# EAGLE schematic Backplane (EAGLE 9.6.2)
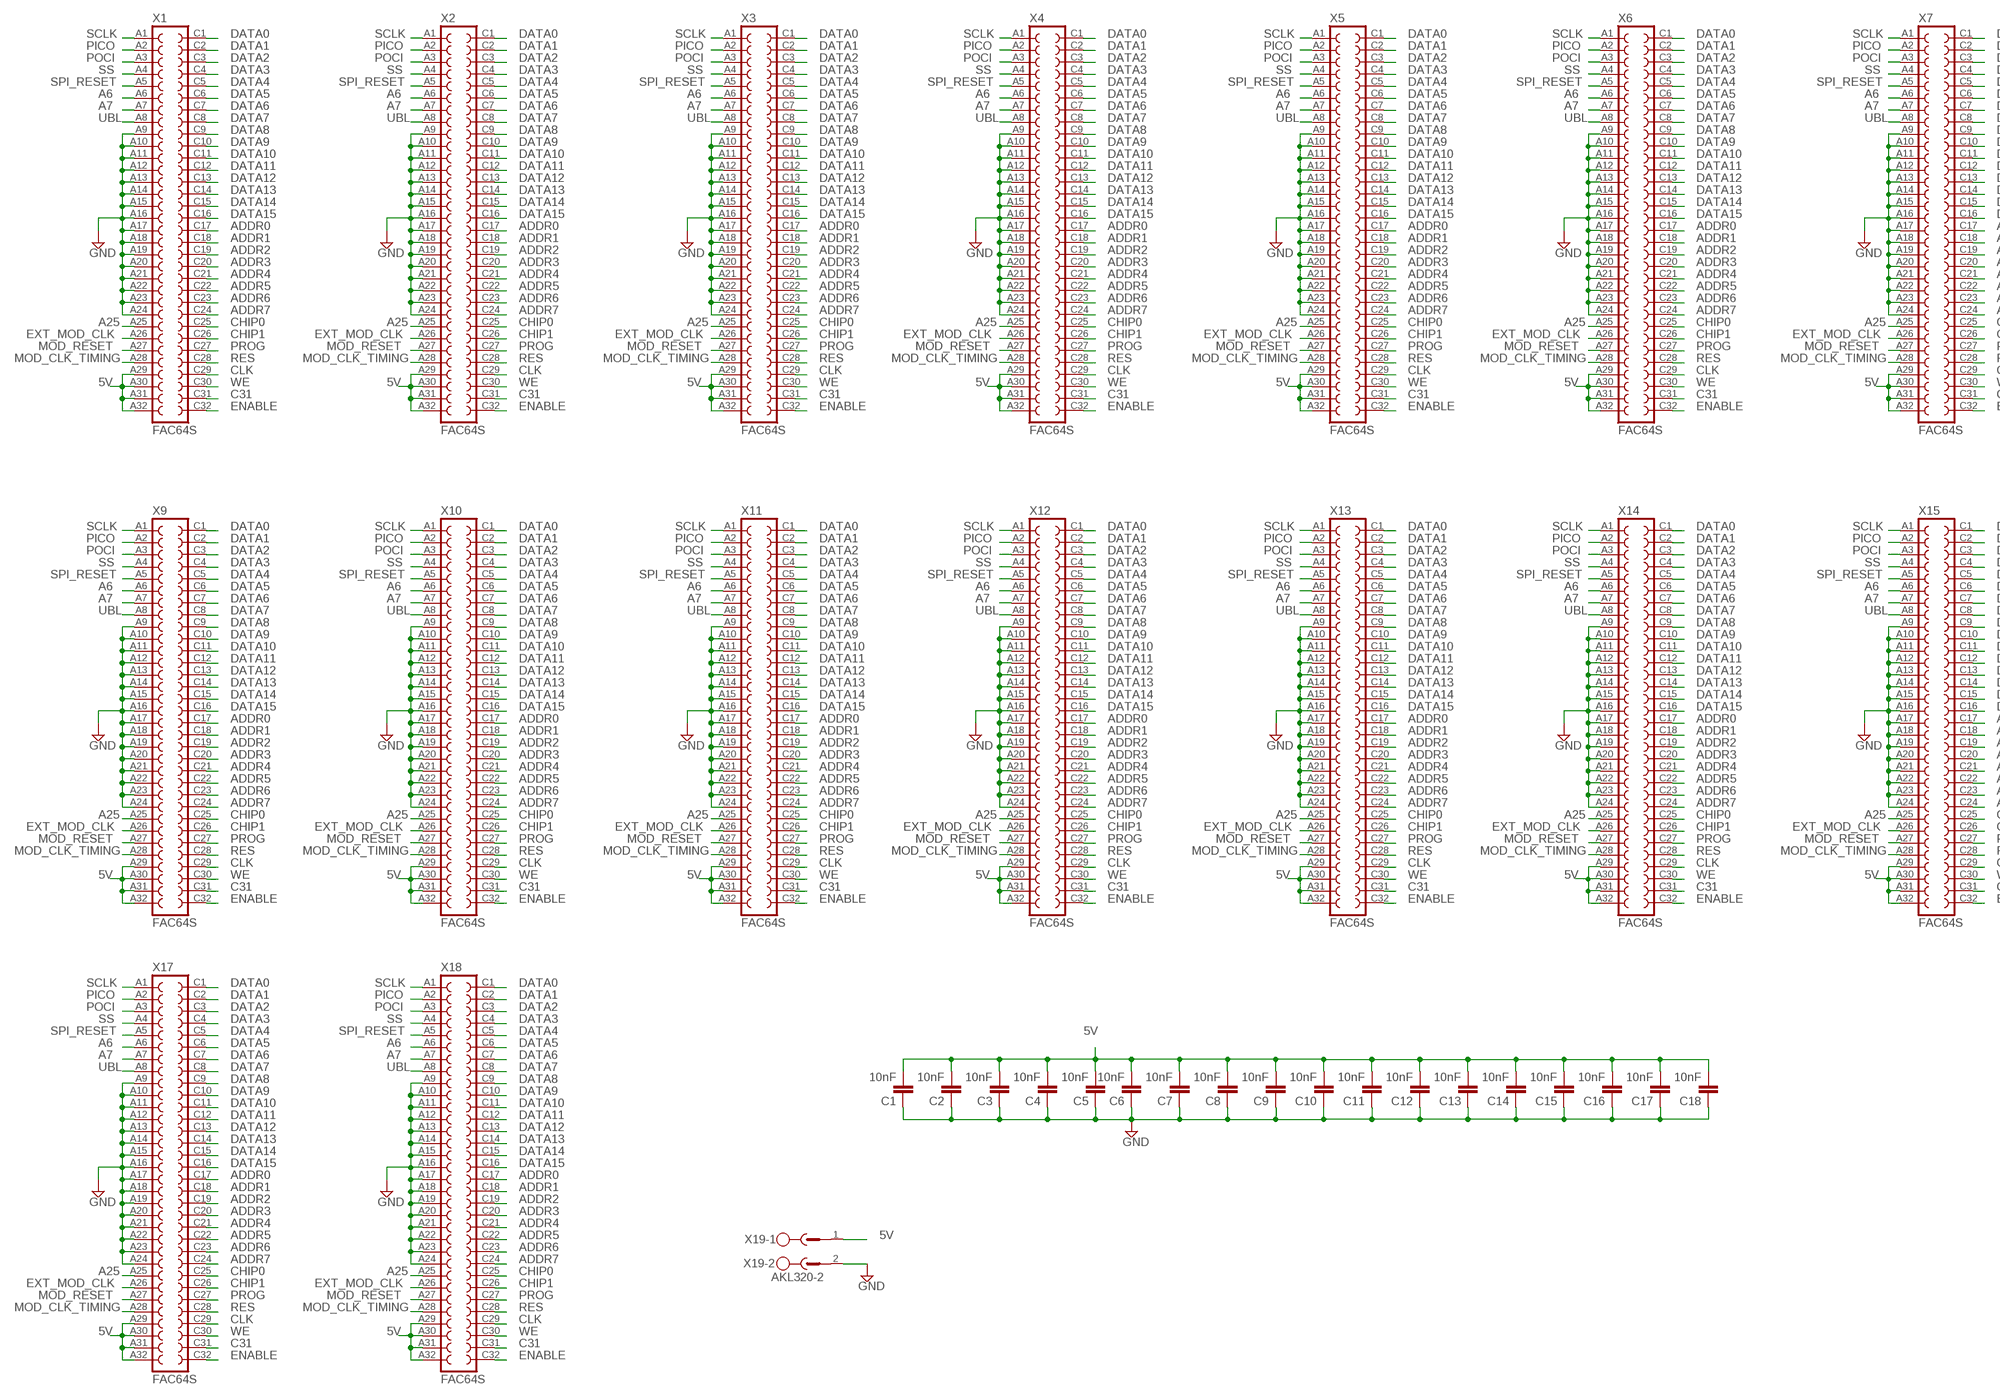
[diagram p0: schematic, sheet 1, part 1 of 2]
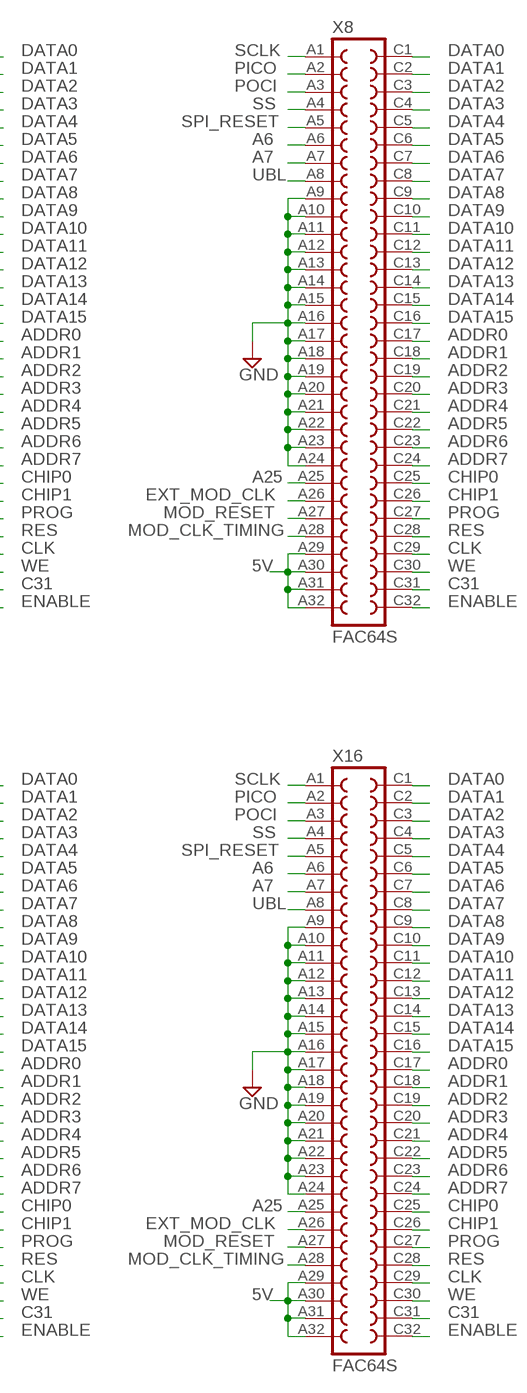
[diagram p1: schematic, sheet 1, part 2 of 2]

## Parts
C1  10nF  C-EUC0603  [C0603]
C2  10nF  C-EUC0603  [C0603]
C3  10nF  C-EUC0603  [C0603]
C4  10nF  C-EUC0603  [C0603]
C5  10nF  C-EUC0603  [C0603]
C6  10nF  C-EUC0603  [C0603]
C7  10nF  C-EUC0603  [C0603]
C8  10nF  C-EUC0603  [C0603]
C9  10nF  C-EUC0603  [C0603]
C10  10nF  C-EUC0603  [C0603]
C11  10nF  C-EUC0603  [C0603]
C12  10nF  C-EUC0603  [C0603]
C13  10nF  C-EUC0603  [C0603]
C14  10nF  C-EUC0603  [C0603]
C15  10nF  C-EUC0603  [C0603]
C16  10nF  C-EUC0603  [C0603]
C17  10nF  C-EUC0603  [C0603]
C18  10nF  C-EUC0603  [C0603]
X1  FAC64S  [FAC64S]
X2  FAC64S  [FAC64S]
X3  FAC64S  [FAC64S]
X4  FAC64S  [FAC64S]
X5  FAC64S  [FAC64S]
X6  FAC64S  [FAC64S]
X7  FAC64S  [FAC64S]
X8  FAC64S  [FAC64S]
X9  FAC64S  [FAC64S]
X10  FAC64S  [FAC64S]
X11  FAC64S  [FAC64S]
X12  FAC64S  [FAC64S]
X13  FAC64S  [FAC64S]
X14  FAC64S  [FAC64S]
X15  FAC64S  [FAC64S]
X16  FAC64S  [FAC64S]
X17  FAC64S  [FAC64S]
X18  FAC64S  [FAC64S]
X19  AKL320-2  MSTBV2  [MSTBV2]

## Nets
5V: C1.2 C2.2 C3.2 C4.2 C5.2 C6.2 C7.2 C8.2 C9.2 C10.2 C11.2 C12.2 C13.2 C14.2 C15.2 C16.2 C17.2 C18.2 X1.A29 X1.A30 X1.A31 X1.A32 X2.A29 X2.A30 X2.A31 X2.A32 X3.A29 X3.A30 X3.A31 X3.A32 X4.A29 X4.A30 X4.A31 X4.A32 X5.A29 X5.A30 X5.A31 X5.A32 X6.A29 X6.A30 X6.A31 X6.A32 X7.A29 X7.A30 X7.A31 X7.A32 X8.A29 X8.A30 X8.A31 X8.A32 X9.A29 X9.A30 X9.A31 X9.A32 X10.A29 X10.A30 X10.A31 X10.A32 X11.A29 X11.A30 X11.A31 X11.A32 X12.A29 X12.A30 X12.A31 X12.A32 X13.A29 X13.A30 X13.A31 X13.A32 X14.A29 X14.A30 X14.A31 X14.A32 X15.A29 X15.A30 X15.A31 X15.A32 X16.A29 X16.A30 X16.A31 X16.A32 X17.A29 X17.A30 X17.A31 X17.A32 X18.A29 X18.A30 X18.A31 X18.A32 X19.1
A6: X1.A6 X2.A6 X3.A6 X4.A6 X5.A6 X6.A6 X7.A6 X8.A6 X9.A6 X10.A6 X11.A6 X12.A6 X13.A6 X14.A6 X15.A6 X16.A6 X17.A6 X18.A6
A7: X1.A7 X2.A7 X3.A7 X4.A7 X5.A7 X6.A7 X7.A7 X8.A7 X9.A7 X10.A7 X11.A7 X12.A7 X13.A7 X14.A7 X15.A7 X16.A7 X17.A7 X18.A7
A25: X1.A25 X2.A25 X3.A25 X4.A25 X5.A25 X6.A25 X7.A25 X8.A25 X9.A25 X10.A25 X11.A25 X12.A25 X13.A25 X14.A25 X15.A25 X16.A25 X17.A25 X18.A25
ADDR0: X1.C17 X2.C17 X3.C17 X4.C17 X5.C17 X6.C17 X7.C17 X8.C17 X9.C17 X10.C17 X11.C17 X12.C17 X13.C17 X14.C17 X15.C17 X16.C17 X17.C17 X18.C17
ADDR1: X1.C18 X2.C18 X3.C18 X4.C18 X5.C18 X6.C18 X7.C18 X8.C18 X9.C18 X10.C18 X11.C18 X12.C18 X13.C18 X14.C18 X15.C18 X16.C18 X17.C18 X18.C18
ADDR2: X1.C19 X2.C19 X3.C19 X4.C19 X5.C19 X6.C19 X7.C19 X8.C19 X9.C19 X10.C19 X11.C19 X12.C19 X13.C19 X14.C19 X15.C19 X16.C19 X17.C19 X18.C19
ADDR3: X1.C20 X2.C20 X3.C20 X4.C20 X5.C20 X6.C20 X7.C20 X8.C20 X9.C20 X10.C20 X11.C20 X12.C20 X13.C20 X14.C20 X15.C20 X16.C20 X17.C20 X18.C20
ADDR4: X1.C21 X2.C21 X3.C21 X4.C21 X5.C21 X6.C21 X7.C21 X8.C21 X9.C21 X10.C21 X11.C21 X12.C21 X13.C21 X14.C21 X15.C21 X16.C21 X17.C21 X18.C21
ADDR5: X1.C22 X2.C22 X3.C22 X4.C22 X5.C22 X6.C22 X7.C22 X8.C22 X9.C22 X10.C22 X11.C22 X12.C22 X13.C22 X14.C22 X15.C22 X16.C22 X17.C22 X18.C22
ADDR6: X1.C23 X2.C23 X3.C23 X4.C23 X5.C23 X6.C23 X7.C23 X8.C23 X9.C23 X10.C23 X11.C23 X12.C23 X13.C23 X14.C23 X15.C23 X16.C23 X17.C23 X18.C23
ADDR7: X1.C24 X2.C24 X3.C24 X4.C24 X5.C24 X6.C24 X7.C24 X8.C24 X9.C24 X10.C24 X11.C24 X12.C24 X13.C24 X14.C24 X15.C24 X16.C24 X17.C24 X18.C24
C31: X1.C31 X2.C31 X3.C31 X4.C31 X5.C31 X6.C31 X7.C31 X8.C31 X9.C31 X10.C31 X11.C31 X12.C31 X13.C31 X14.C31 X15.C31 X16.C31 X17.C31 X18.C31
CHIP0: X1.C25 X2.C25 X3.C25 X4.C25 X5.C25 X6.C25 X7.C25 X8.C25 X9.C25 X10.C25 X11.C25 X12.C25 X13.C25 X14.C25 X15.C25 X16.C25 X17.C25 X18.C25
CHIP1: X1.C26 X2.C26 X3.C26 X4.C26 X5.C26 X6.C26 X7.C26 X8.C26 X9.C26 X10.C26 X11.C26 X12.C26 X13.C26 X14.C26 X15.C26 X16.C26 X17.C26 X18.C26
CLK: X1.C29 X2.C29 X3.C29 X4.C29 X5.C29 X6.C29 X7.C29 X8.C29 X9.C29 X10.C29 X11.C29 X12.C29 X13.C29 X14.C29 X15.C29 X16.C29 X17.C29 X18.C29
DATA0: X1.C1 X2.C1 X3.C1 X4.C1 X5.C1 X6.C1 X7.C1 X8.C1 X9.C1 X10.C1 X11.C1 X12.C1 X13.C1 X14.C1 X15.C1 X16.C1 X17.C1 X18.C1
DATA1: X1.C2 X2.C2 X3.C2 X4.C2 X5.C2 X6.C2 X7.C2 X8.C2 X9.C2 X10.C2 X11.C2 X12.C2 X13.C2 X14.C2 X15.C2 X16.C2 X17.C2 X18.C2
DATA2: X1.C3 X2.C3 X3.C3 X4.C3 X5.C3 X6.C3 X7.C3 X8.C3 X9.C3 X10.C3 X11.C3 X12.C3 X13.C3 X14.C3 X15.C3 X16.C3 X17.C3 X18.C3
DATA3: X1.C4 X2.C4 X3.C4 X4.C4 X5.C4 X6.C4 X7.C4 X8.C4 X9.C4 X10.C4 X11.C4 X12.C4 X13.C4 X14.C4 X15.C4 X16.C4 X17.C4 X18.C4
DATA4: X1.C5 X2.C5 X3.C5 X4.C5 X5.C5 X6.C5 X7.C5 X8.C5 X9.C5 X10.C5 X11.C5 X12.C5 X13.C5 X14.C5 X15.C5 X16.C5 X17.C5 X18.C5
DATA5: X1.C6 X2.C6 X3.C6 X4.C6 X5.C6 X6.C6 X7.C6 X8.C6 X9.C6 X10.C6 X11.C6 X12.C6 X13.C6 X14.C6 X15.C6 X16.C6 X17.C6 X18.C6
DATA6: X1.C7 X2.C7 X3.C7 X4.C7 X5.C7 X6.C7 X7.C7 X8.C7 X9.C7 X10.C7 X11.C7 X12.C7 X13.C7 X14.C7 X15.C7 X16.C7 X17.C7 X18.C7
DATA7: X1.C8 X2.C8 X3.C8 X4.C8 X5.C8 X6.C8 X7.C8 X8.C8 X9.C8 X10.C8 X11.C8 X12.C8 X13.C8 X14.C8 X15.C8 X16.C8 X17.C8 X18.C8
DATA8: X1.C9 X2.C9 X3.C9 X4.C9 X5.C9 X6.C9 X7.C9 X8.C9 X9.C9 X10.C9 X11.C9 X12.C9 X13.C9 X14.C9 X15.C9 X16.C9 X17.C9 X18.C9
DATA9: X1.C10 X2.C10 X3.C10 X4.C10 X5.C10 X6.C10 X7.C10 X8.C10 X9.C10 X10.C10 X11.C10 X12.C10 X13.C10 X14.C10 X15.C10 X16.C10 X17.C10 X18.C10
DATA10: X1.C11 X2.C11 X3.C11 X4.C11 X5.C11 X6.C11 X7.C11 X8.C11 X9.C11 X10.C11 X11.C11 X12.C11 X13.C11 X14.C11 X15.C11 X16.C11 X17.C11 X18.C11
DATA11: X1.C12 X2.C12 X3.C12 X4.C12 X5.C12 X6.C12 X7.C12 X8.C12 X9.C12 X10.C12 X11.C12 X12.C12 X13.C12 X14.C12 X15.C12 X16.C12 X17.C12 X18.C12
DATA12: X1.C13 X2.C13 X3.C13 X4.C13 X5.C13 X6.C13 X7.C13 X8.C13 X9.C13 X10.C13 X11.C13 X12.C13 X13.C13 X14.C13 X15.C13 X16.C13 X17.C13 X18.C13
DATA13: X1.C14 X2.C14 X3.C14 X4.C14 X5.C14 X6.C14 X7.C14 X8.C14 X9.C14 X10.C14 X11.C14 X12.C14 X13.C14 X14.C14 X15.C14 X16.C14 X17.C14 X18.C14
DATA14: X1.C15 X2.C15 X3.C15 X4.C15 X5.C15 X6.C15 X7.C15 X8.C15 X9.C15 X10.C15 X11.C15 X12.C15 X13.C15 X14.C15 X15.C15 X16.C15 X17.C15 X18.C15
DATA15: X1.C16 X2.C16 X3.C16 X4.C16 X5.C16 X6.C16 X7.C16 X8.C16 X9.C16 X10.C16 X11.C16 X12.C16 X13.C16 X14.C16 X15.C16 X16.C16 X17.C16 X18.C16
ENABLE: X1.C32 X2.C32 X3.C32 X4.C32 X5.C32 X6.C32 X7.C32 X8.C32 X9.C32 X10.C32 X11.C32 X12.C32 X13.C32 X14.C32 X15.C32 X16.C32 X17.C32 X18.C32
EXT_MOD_CLK: X1.A26 X2.A26 X3.A26 X4.A26 X5.A26 X6.A26 X7.A26 X8.A26 X9.A26 X10.A26 X11.A26 X12.A26 X13.A26 X14.A26 X15.A26 X16.A26 X17.A26 X18.A26
GND: C1.1 C2.1 C3.1 C4.1 C5.1 C6.1 C7.1 C8.1 C9.1 C10.1 C11.1 C12.1 C13.1 C14.1 C15.1 C16.1 C17.1 C18.1 X1.A9 X1.A10 X1.A11 X1.A12 X1.A13 X1.A14 X1.A15 X1.A16 X1.A17 X1.A18 X1.A19 X1.A20 X1.A21 X1.A22 X1.A23 X1.A24 X2.A9 X2.A10 X2.A11 X2.A12 X2.A13 X2.A14 X2.A15 X2.A16 X2.A17 X2.A18 X2.A19 X2.A20 X2.A21 X2.A22 X2.A23 X2.A24 X3.A9 X3.A10 X3.A11 X3.A12 X3.A13 X3.A14 X3.A15 X3.A16 X3.A17 X3.A18 X3.A19 X3.A20 X3.A21 X3.A22 X3.A23 X3.A24 X4.A9 X4.A10 X4.A11 X4.A12 X4.A13 X4.A14 X4.A15 X4.A16 X4.A17 X4.A18 X4.A19 X4.A20 X4.A21 X4.A22 X4.A23 X4.A24 X5.A9 X5.A10 X5.A11 X5.A12 X5.A13 X5.A14 X5.A15 X5.A16 X5.A17 X5.A18 X5.A19 X5.A20 X5.A21 X5.A22 X5.A23 X5.A24 X6.A9 X6.A10 X6.A11 X6.A12 X6.A13 X6.A14 X6.A15 X6.A16 X6.A17 X6.A18 X6.A19 X6.A20 X6.A21 X6.A22 X6.A23 X6.A24 X7.A9 X7.A10 X7.A11 X7.A12 X7.A13 X7.A14 X7.A15 X7.A16 X7.A17 X7.A18 X7.A19 X7.A20 X7.A21 X7.A22 X7.A23 X7.A24 X8.A9 X8.A10 X8.A11 X8.A12 X8.A13 X8.A14 X8.A15 X8.A16 X8.A17 X8.A18 X8.A19 X8.A20 X8.A21 X8.A22 X8.A23 X8.A24 X9.A9 X9.A10 X9.A11 X9.A12 X9.A13 X9.A14 X9.A15 X9.A16 X9.A17 X9.A18 X9.A19 X9.A20 X9.A21 X9.A22 X9.A23 X9.A24 X10.A9 X10.A10 X10.A11 X10.A12 X10.A13 X10.A14 X10.A15 X10.A16 X10.A17 X10.A18 X10.A19 X10.A20 X10.A21 X10.A22 X10.A23 X10.A24 X11.A9 X11.A10 X11.A11 X11.A12 X11.A13 X11.A14 X11.A15 X11.A16 X11.A17 X11.A18 X11.A19 X11.A20 X11.A21 X11.A22 X11.A23 X11.A24 X12.A9 X12.A10 X12.A11 X12.A12 X12.A13 X12.A14 X12.A15 X12.A16 X12.A17 X12.A18 X12.A19 X12.A20 X12.A21 X12.A22 X12.A23 X12.A24 X13.A9 X13.A10 X13.A11 X13.A12 X13.A13 X13.A14 X13.A15 X13.A16 X13.A17 X13.A18 X13.A19 X13.A20 X13.A21 X13.A22 X13.A23 X13.A24 X14.A9 X14.A10 X14.A11 X14.A12 X14.A13 X14.A14 X14.A15 X14.A16 X14.A17 X14.A18 X14.A19 X14.A20 X14.A21 X14.A22 X14.A23 X14.A24 X15.A9 X15.A10 X15.A11 X15.A12 X15.A13 X15.A14 X15.A15 X15.A16 X15.A17 X15.A18 X15.A19 X15.A20 X15.A21 X15.A22 X15.A23 X15.A24 X16.A9 X16.A10 X16.A11 X16.A12 X16.A13 X16.A14 X16.A15 X16.A16 X16.A17 X16.A18 X16.A19 X16.A20 X16.A21 X16.A22 X16.A23 X16.A24 X17.A9 X17.A10 X17.A11 X17.A12 X17.A13 X17.A14 X17.A15 X17.A16 X17.A17 X17.A18 X17.A19 X17.A20 X17.A21 X17.A22 X17.A23 X17.A24 X18.A9 X18.A10 X18.A11 X18.A12 X18.A13 X18.A14 X18.A15 X18.A16 X18.A17 X18.A18 X18.A19 X18.A20 X18.A21 X18.A22 X18.A23 X18.A24 X19.2
MOD_CLK_TIMING: X1.A28 X2.A28 X3.A28 X4.A28 X5.A28 X6.A28 X7.A28 X8.A28 X9.A28 X10.A28 X11.A28 X12.A28 X13.A28 X14.A28 X15.A28 X16.A28 X17.A28 X18.A28
MOD_RESET: X1.A27 X2.A27 X3.A27 X4.A27 X5.A27 X6.A27 X7.A27 X8.A27 X9.A27 X10.A27 X11.A27 X12.A27 X13.A27 X14.A27 X15.A27 X16.A27 X17.A27 X18.A27
PICO: X1.A2 X2.A2 X3.A2 X4.A2 X5.A2 X6.A2 X7.A2 X8.A2 X9.A2 X10.A2 X11.A2 X12.A2 X13.A2 X14.A2 X15.A2 X16.A2 X17.A2 X18.A2
POCI: X1.A3 X2.A3 X3.A3 X4.A3 X5.A3 X6.A3 X7.A3 X8.A3 X9.A3 X10.A3 X11.A3 X12.A3 X13.A3 X14.A3 X15.A3 X16.A3 X17.A3 X18.A3
PROG: X1.C27 X2.C27 X3.C27 X4.C27 X5.C27 X6.C27 X7.C27 X8.C27 X9.C27 X10.C27 X11.C27 X12.C27 X13.C27 X14.C27 X15.C27 X16.C27 X17.C27 X18.C27
RES: X1.C28 X2.C28 X3.C28 X4.C28 X5.C28 X6.C28 X7.C28 X8.C28 X9.C28 X10.C28 X11.C28 X12.C28 X13.C28 X14.C28 X15.C28 X16.C28 X17.C28 X18.C28
SCLK: X1.A1 X2.A1 X3.A1 X4.A1 X5.A1 X6.A1 X7.A1 X8.A1 X9.A1 X10.A1 X11.A1 X12.A1 X13.A1 X14.A1 X15.A1 X16.A1 X17.A1 X18.A1
SPI_RESET: X1.A5 X2.A5 X3.A5 X4.A5 X5.A5 X6.A5 X7.A5 X8.A5 X9.A5 X10.A5 X11.A5 X12.A5 X13.A5 X14.A5 X15.A5 X16.A5 X17.A5 X18.A5
SS: X1.A4 X2.A4 X3.A4 X4.A4 X5.A4 X6.A4 X7.A4 X8.A4 X9.A4 X10.A4 X11.A4 X12.A4 X13.A4 X14.A4 X15.A4 X16.A4 X17.A4 X18.A4
UBL: X1.A8 X2.A8 X3.A8 X4.A8 X5.A8 X6.A8 X7.A8 X8.A8 X9.A8 X10.A8 X11.A8 X12.A8 X13.A8 X14.A8 X15.A8 X16.A8 X17.A8 X18.A8
WE: X1.C30 X2.C30 X3.C30 X4.C30 X5.C30 X6.C30 X7.C30 X8.C30 X9.C30 X10.C30 X11.C30 X12.C30 X13.C30 X14.C30 X15.C30 X16.C30 X17.C30 X18.C30

## Library data of the parts
C1-C18 = rcl:C-EU: CAPACITOR, European symbol; SPICEPREFIX: C
X1-X18 = con-vg:FAC64S: CONNECTOR female, 64 pins, block, type C, rows AC, grid 5.08 mm
X19 = con-phoenix-500:MSTBV2: PHOENIX; OC_FARNELL: unknown; OC_NEWARK: unknown